# EAGLE design jdt1800-v0.2 (EAGLE 6.1)
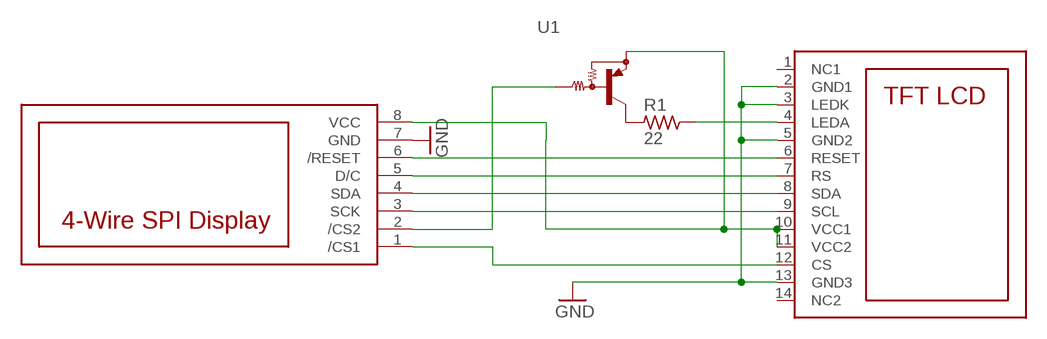
[diagram p0: schematic, sheet 1]

## Parts
R1  22  R_0603  [R0603]
U1  PNP-DRIVERSOT323  [SOT323R]
U$1  TFT1.8"  [1.8TFT]
U$2  4W-SPI-DISP  [1X08-NOSILK]

## Nets
GND: U$1.2(GND1) U$1.3(LEDK) U$1.5(GND2) U$1.13(GND3) U$2.7(GND)
N$1: R1.1 U1.3(C)
N$2: U1.2(E) U$1.10(VCC1) U$1.11(VCC2) U$2.8(VCC)
N$3: U1.1(B) U$2.2(/CS2)
N$4: U$1.6(RESET) U$2.6(/RESET)
N$5: U$1.7(RS) U$2.5(D/C)
N$6: U$1.8(SDA) U$2.4(SDA)
N$7: U$1.9(SCL) U$2.3(SCK)
N$8: U$1.12(CS) U$2.1(/CS1)
N$9: R1.2 U$1.4(LEDA)
Unconnected: U$1.1(NC1) U$1.14(NC2)

## Library data of the parts
R1 = rc-master-smd:R_: RESISTOR
U1 = es:PNP-DRIVER
U$1 = es:TFT
U$2 = es:4W-SPI-DISP

## Board
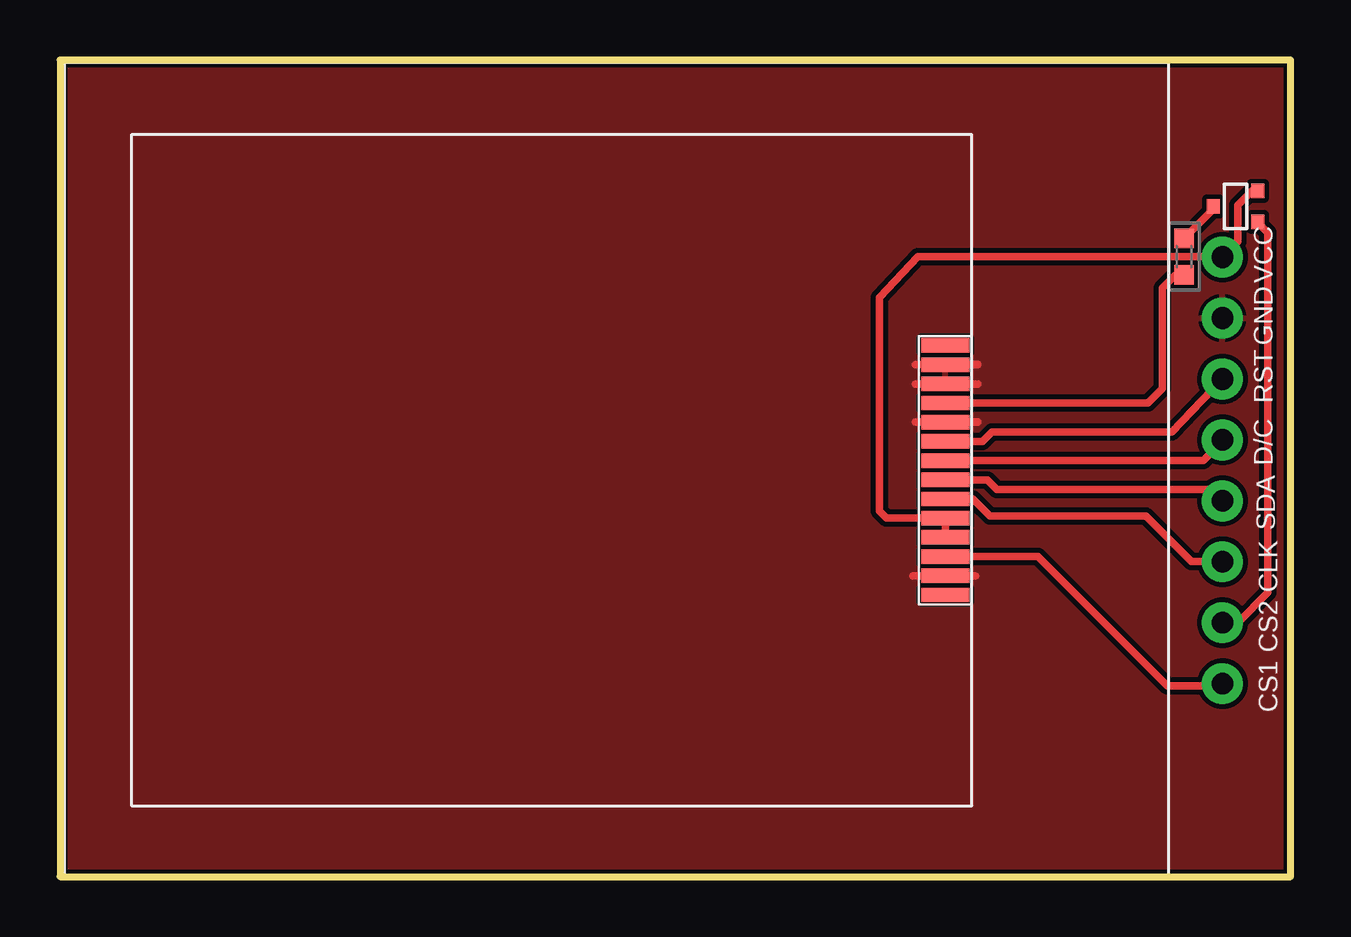
[diagram p1: board, top side]

Size 51.3 x 34.05 mm. Coordinates in mm from the lower left corner, seen from the top.
Outline: 0,34.05 0,0 51.3,0 51.3,34.05 0,34.05
Copper layers (1*16): Top 0.035mm / dielectric 1.5mm / Bottom 0.035mm
Design rules: minimum track width 0.15mm, minimum drill 0.3mm, track to track 0.2mm, track to pad 0.2mm, pad to pad 0.2mm, via to via 0.2mm, smd to smd 0.2mm, copper to edge 0.15mm, drill to drill 0.15mm, minimum pad ring 0.4mm, minimum via ring 0.4mm, stop-mask expansion 0mil, vias tented up to drill 25mil, thermal gap 0.15mm

### Footprints (pad centres in the part's own frame; a part is rotated, then mirrored left to right if it is on the bottom)
R0603 = smd 0.8 x 0.8: 1 -0.762,0; 2 0.762,0
SOT323R = smd 0.6 x 0.55: 1 -0.65,-0.925; 2 0.65,-0.925; 3 0,0.925
1.8TFT = smd 0.6 x 2: 1 5.2,9.3; 2 4.4,9.3; 3 3.6,9.3; 4 2.8,9.3; 5 2,9.3; 6 1.2,9.3; 7 0.4,9.3; 8 -0.4,9.3; 9 -1.2,9.3; 10 -2,9.3; 11 -2.8,9.3; 12 -3.6,9.3; 13 -4.4,9.3; 14 -5.2,9.3
1X08-NOSILK = drill 0.9: 1 0,0; 2 2.54,0; 3 5.08,0; 4 7.62,0; 5 10.16,0; 6 12.7,0; 7 15.24,0; 8 17.78,0

### Placement (x,y rotation side)
R1  46.85,25.85 270 top
U1  49,27.95 90 top
U$1  46.2,16.95 90 top
U$2  48.45,8.05 90 top

### Tracks (layer width: path | path; a pad name or v marks a point on that pad's centre or on a via)
GND
  Top 0.32: 35.65,18.95 38.25,18.95 | 35.55,12.55 38.15,12.55 | 35.65,20.55 38.25,20.55 | 35.65,21.35 38.25,21.35
  pour Top: -7.05,-0.45 54.75,-0.45 54.75,34.95 -7.05,34.95
N$1
  Top 0.32: R1.1 48.09,27.85 48.08,27.85 U1.3
N$2
  Top 0.32: U$1.11 U$1.10 34.45,14.95 34.15,15.25 34.15,24.15 35.75,25.85 48.43,25.85 U$2.8 49.1,26.48 49.1,28 49.7,28.6 U1.2
N$3
  Top 0.32: U$2.2 49.09,10.59 50.35,11.85 50.35,26.85 49.93,27.27 U1.1
N$4
  Top 0.32: U$1.6 38.45,18.15 38.85,18.55 46.35,18.55 U$2.6
N$5
  Top 0.32: U$2.5 48.51,18.21 47.65,17.35 U$1.7
N$6
  Top 0.32: U$1.8 38.65,16.55 39.05,16.15 47.97,16.15 U$2.4
N$7
  Top 0.32: U$1.9 38.05,15.75 38.75,15.05 45.25,15.05 47.15,13.15 48.43,13.15 U$2.3
N$8
  Top 0.32: U$1.12 40.75,13.35 46.15,7.95 48.35,7.95 U$2.1
N$9
  Top 0.32: R1.2 46.49,25.09 45.95,24.55 45.95,20.35 45.35,19.75 U$1.4

### Text on the board
tNames: VCC | GND | RST | D/C | SDA | CLK | CS2 | CS1